# EAGLE design RH045.2 (EAGLE 7.1.0)
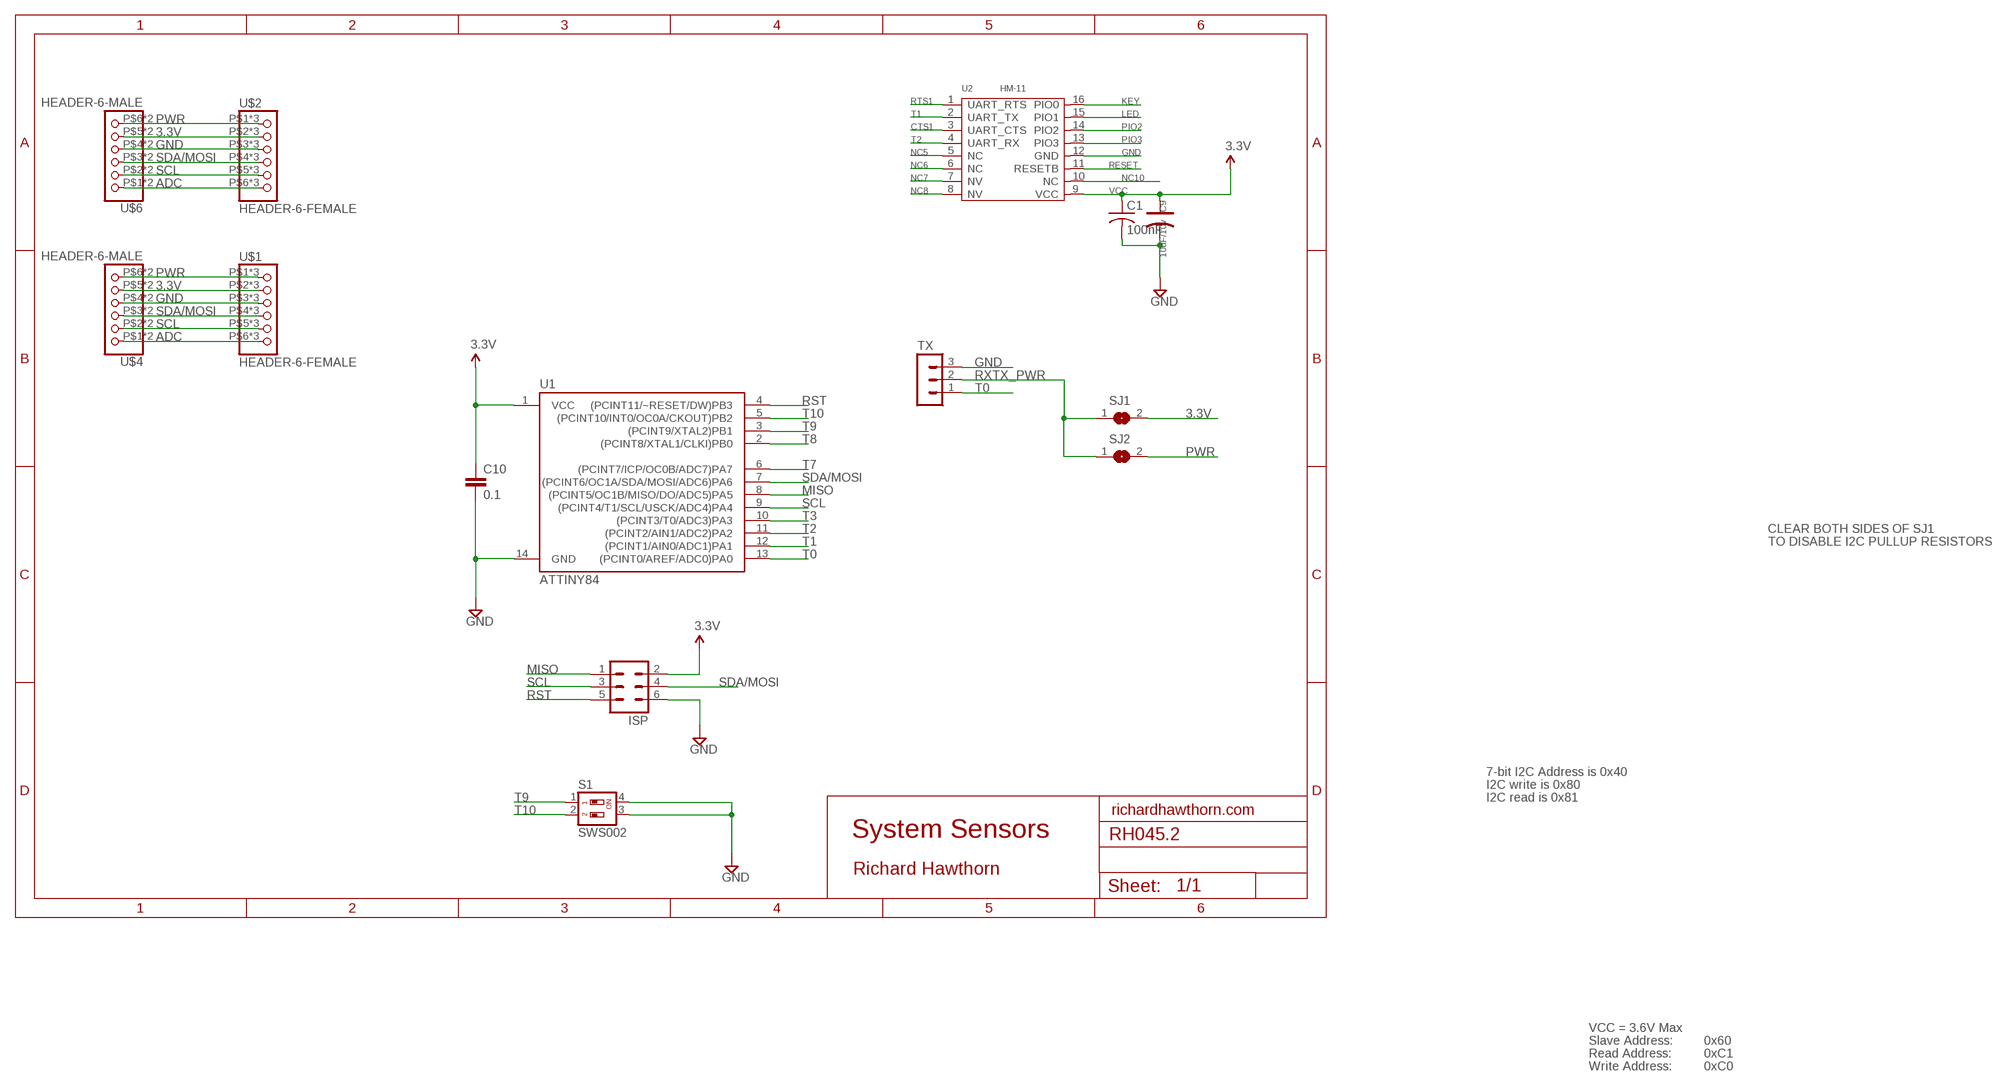
[diagram p0: schematic, sheet 1]

## Parts
C1  100nF  C-USC0805  [C0805]
C9  10uF/10v  CAP-AVX-A  [AVX-A]
C10  0.1  CAP0603-CAP  [0603-CAP]
ISP  MA03-2  [MA03-2]
S1  SWS002  [SMS-002]
SJ1  SJ  [SJ]
SJ2  SJ  [SJ]
TX  MA03-1  [MA03-1]
U1  ATTINY84  [SO14]
U2  HM-11  [16P-18.5X13.5X0.8]
U$1  HEADER-6-FEMALE  [2MMHEADER6]
U$2  HEADER-6-FEMALE  [2MMHEADER6]
U$4  HEADER-6-MALE  [2MMHEADERPIN6]
U$6  HEADER-6-MALE  [2MMHEADERPIN6]

## Nets
3.3V: C10.1 ISP.2 SJ1.2 U1.1(VCC) U$1.P$2 U$1.P$10 U$1.P$18 U$2.P$2 U$2.P$10 U$2.P$18 U$4.P$5 U$4.P$13 U$6.P$5 U$6.P$13
ADC: U$1.P$6 U$1.P$14 U$1.P$22 U$2.P$6 U$2.P$14 U$2.P$22 U$4.P$1 U$4.P$9 U$6.P$1 U$6.P$9
CTS1: U2.3(UART_CTS)
GND [power]: C1.2 C9.- C10.2 ISP.6 S1.3 S1.4 TX.3 U1.14(GND) U2.12(GND) U$1.P$3 U$1.P$11 U$1.P$19 U$2.P$3 U$2.P$11 U$2.P$19 U$4.P$4 U$4.P$12 U$6.P$4 U$6.P$12
KEY: U2.16(PIO0)
LED: U2.15(PIO1)
MISO: ISP.1 U1.8((PCINT5/OC1B/MISO/DO/ADC5)PA5)
NC5: U2.5(NC)
NC6: U2.6(NC)
NC7: U2.7(NV)
NC8: U2.8(NV)
NC10: U2.10(NC)
PIO2: U2.14(PIO2)
PIO3: U2.13(PIO3)
PWR [power]: SJ2.2 U$1.P$1 U$1.P$9 U$1.P$17 U$2.P$1 U$2.P$9 U$2.P$17 U$4.P$6 U$4.P$14 U$6.P$6 U$6.P$14
RESET: U2.11(RESETB)
RST: ISP.5 U1.4((PCINT11/~RESET/DW)PB3)
RTS1: U2.1(UART_RTS)
RXTX_PWR: SJ1.1 SJ2.1 TX.2
SCL: ISP.3 U1.9((PCINT4/T1/SCL/USCK/ADC4)PA4) U$1.P$5 U$1.P$13 U$1.P$21 U$2.P$5 U$2.P$13 U$2.P$21 U$4.P$2 U$4.P$10 U$6.P$2 U$6.P$10
SDA/MOSI: ISP.4 U1.7((PCINT6/OC1A/SDA/MOSI/ADC6)PA6) U$1.P$4 U$1.P$12 U$1.P$20 U$2.P$4 U$2.P$12 U$2.P$20 U$4.P$3 U$4.P$11 U$6.P$3 U$6.P$11
T0: TX.1 U1.13((PCINT0/AREF/ADC0)PA0)
T1: U1.12((PCINT1/AIN0/ADC1)PA1) U2.2(UART_TX)
T2: U1.11((PCINT2/AIN1/ADC2)PA2) U2.4(UART_RX)
T3: U1.10((PCINT3/T0/ADC3)PA3)
T7: U1.6((PCINT7/ICP/OC0B/ADC7)PA7)
T8: U1.2((PCINT8/XTAL1/CLKI)PB0)
T9: S1.1 U1.3((PCINT9/XTAL2)PB1)
T10: S1.2 U1.5((PCINT10/INT0/OC0A/CKOUT)PB2)
VCC: C1.1 C9.+ U2.9(VCC) ; supply symbol labelled 3.3V

## Notes on the sheet
- CLEAR BOTH SIDES OF SJ1
- TO DISABLE I2C PULLUP RESISTORS
- 7-bit I2C Address is 0x40
- I2C write is 0x80
- I2C read is 0x81
- richardhawthorn.com
- System Sensors
- Richard Hawthorn
- VCC = 3.6V Max
- Slave Address: | 0x60
- Read Address: | 0xC1
- Write Address: | 0xC0

## Library data of the parts
C1 = resistor:C-US: CAPACITOR, American symbol
C9 = Discrete:CAP*: Electrolytic Capacitors,Tantalum Capacitors and Super Capacitors
C10 = LowPowerLab:CAP: Capacitor Standard 0603 ceramic capacitor, and 0.1" leaded capacitor.
ISP = Richards:MA03-2: PIN HEADER; OC_FARNELL: unknown; OC_NEWARK: unknown
S1 = smd-special:SWS002: SMD Dip Switch 2 pol.
SJ1 SJ2 = jumper:SJ: SMD solder JUMPER
TX = con-lstb:MA03-1: PIN HEADER; OC_FARNELL: unknown; OC_NEWARK: unknown
U1 = SparkFun-DigitalIC:ATTINY84: Atmel 14-pin 2/4/8kB flash uC
U2 = template:HM-11: Bluetooth Specification V4.0 BLE
U$1 U$2 = Richards:HEADER-6-FEMALE
U$4 U$6 = Richards:HEADER-6-MALE

## Net classes
1 power: width 0.381 mm, clearance 0.254 mm

## Board
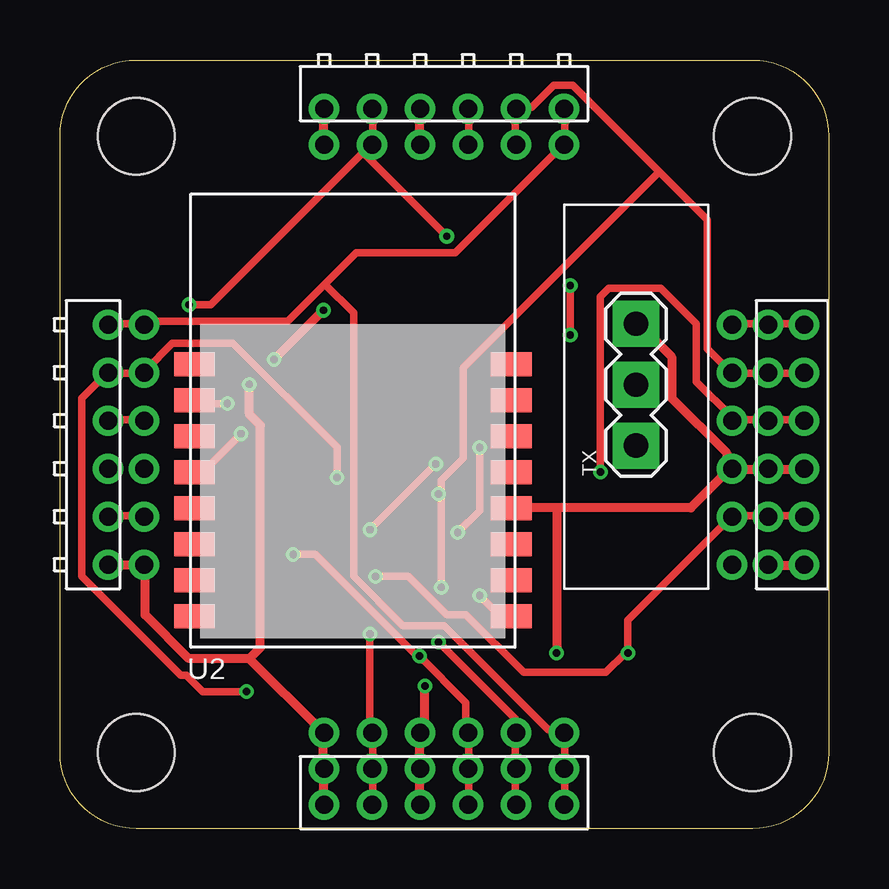
[diagram p1: board, top side]
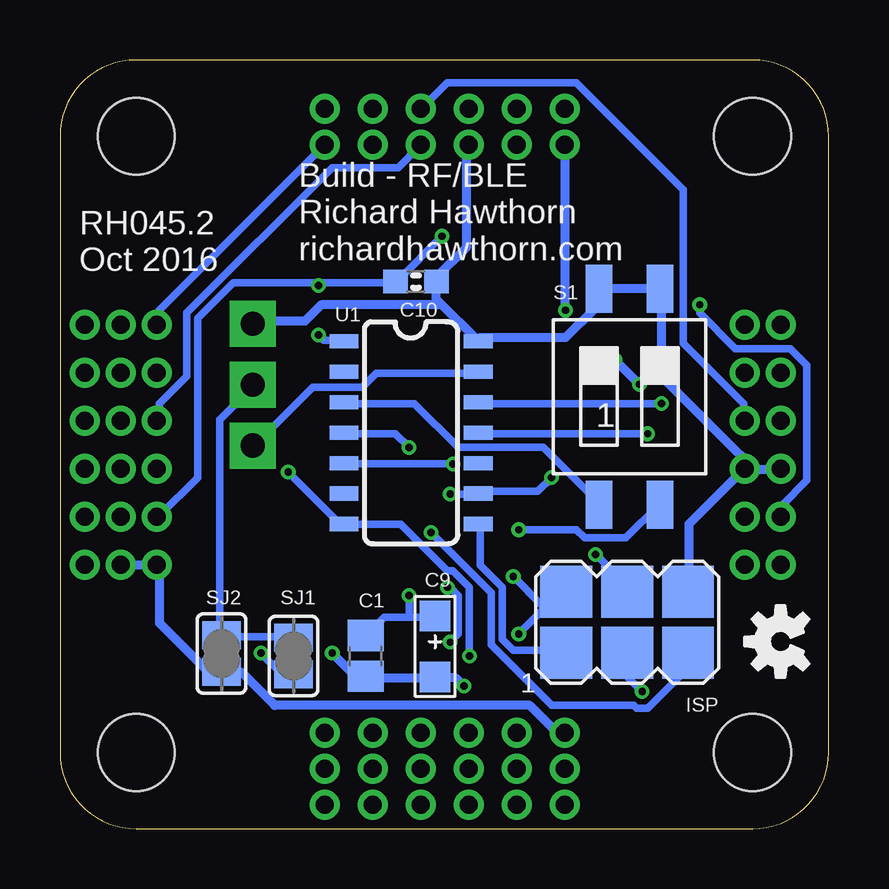
[diagram p2: board, bottom side, seen from below]

Size 32.03 x 32.03 mm. Coordinates in mm from the lower left corner, seen from the top.
Outline: 0,3.17 0,28.86 arc-90 3.17,32.03 28.86,32.03 arc-90 32.03,28.86 32.03,3.17 arc-90 28.86,0 3.17,0 arc-90 0,3.17
Copper layers (1*16): Top 0.035mm / dielectric 1.5mm / Bottom 0.035mm
Design rules "ITEADstudio_DRC *": minimum track width 12mil, minimum drill 12mil, track to track 6mil, track to pad 6mil, pad to pad 6mil, via to via 6mil, smd to smd 0mil, copper to edge 10mil, drill to drill 10mil, minimum pad ring 10mil, minimum via ring 6mil, stop-mask expansion 2mil, vias tented up to drill 100mil, thermal gap 15mil
Holes 3.2 mm at 3.17,3.17 28.86,3.17 3.17,28.86 28.86,28.86
tRestrict: area 0,0 to 5.7,5.7; area 26.3,0 to 32,5.7; area 26.3,26.3 to 32,32; area 0,26.3 to 5.7,32
bRestrict: area 0,26.3 to 5.7,32; area 26.3,26.3 to 32,32; area 26.3,0 to 32,5.7; area 0,0 to 5.7,5.7

### Footprints (pad centres in the part's own frame; a part is rotated, then mirrored left to right if it is on the bottom)
C0805 = smd 1.3 x 1.5: 1 -0.85,0; 2 0.85,0
AVX-A = smd 1.27 x 1.27: + -1.27,0; - 1.27,0
0603-CAP = smd 1.016 x 0.965: 1 -0.85,0; 2 0.85,0
MA03-2 = smd 2.159 x 2.159: 1 -2.54,-1.27; 2 -2.54,1.27; 3 0,-1.27; 4 0,1.27; 5 2.54,-1.27; 6 2.54,1.27
SMS-002 = smd 1.092 x 2.007: 1 -1.27,-4.496; 2 1.27,-4.496; 3 1.27,4.496; 4 -1.27,4.496
SJ = smd 1.168 x 1.6: 1 -0.762,0; 2 0.762,0
MA03-1 = drill 1.016 pad 1.93 square: 1 -2.54,0; 2 0,0; 3 2.54,0
SO14 = smd 0.6 x 1.2: 1 -3.81,-2.8; 2 -2.54,-2.8; 3 -1.27,-2.8; 4 0,-2.8; 5 1.27,-2.8; 6 2.54,-2.8; 7 3.81,-2.8; 8 3.81,2.8; 9 2.54,2.8; 10 1.27,2.8; 11 0,2.8; 12 -1.27,2.8; 13 -2.54,2.8; 14 -3.81,2.8
16P-18.5X13.5X0.8 = smd 1.7 x 1: 1 -6.6,2.15; 2 -6.6,0.65; 3 -6.6,-0.85; 4 -6.6,-2.35; 5 -6.6,-3.85; 6 -6.6,-5.35; 7 -6.6,-6.85; 8 -6.6,-8.35; 9 6.6,-8.35; 10 6.6,-6.85; 11 6.6,-5.35; 12 6.6,-3.85; 13 6.6,-2.35; 14 6.6,-0.85; 15 6.6,0.65; 16 6.6,2.15
2MMHEADER6 = drill 0.75: P$1 1,5; P$2 1,3; P$3 1,1; P$4 1,-1; P$5 1,-3; P$6 1,-5; P$9 -0.5,5; P$10 -0.5,3; P$11 -0.5,1; P$12 -0.5,-1; P$13 -0.5,-3; P$14 -0.5,-5; P$17 -2,5; P$18 -2,3; P$19 -2,1; P$20 -2,-1; P$21 -2,-3; P$22 -2,-5
2MMHEADERPIN6 = drill 0.75: P$1 1,5; P$2 1,3; P$3 1,1; P$4 1,-1; P$5 1,-3; P$6 1,-5; P$9 -0.5,5; P$10 -0.5,3; P$11 -0.5,1; P$12 -0.5,-1; P$13 -0.5,-3; P$14 -0.5,-5

### Placement (x,y rotation side)
C1  19.3,7.2 270 bottom
C9  16.4,7.6 270 bottom
C10  17.2,22.8 0 bottom
ISP  8.4,8.6 0 bottom
S1  8.3,18 0 bottom
SJ1  22.3,7.2 270 bottom
SJ2  25.3,7.3 270 bottom
TX  24,18.5 90 top
U1  17.4,16.5 270 bottom
U2  12.2,17.2 0 top
U$1  29,16 180 top
U$2  16,3 90 top
U$3  [OSHW-LOGO-S]  2,7.8 90 bottom
U$4  16,29.5 270 top
U$6  2.5,16 0 top

### Tracks (layer width: path | path; a pad name or v marks a point on that pad's centre or on a via)
3.3V  (via drill 0.3)
  Top 0.305: U$6.P$13 2.06,13.03 3.43,13.03 U$6.P$5 | U$4.P$5 13.03,28.57 13.03,29.95 U$4.P$13 | v5.37,21.83 6.29,21.83 12.92,28.46 U$4.P$5 | U$2.P$18 13.03,1.03 13.03,2.4 U$2.P$10 13.03,2.63 13.03,3.89 U$2.P$2 12.92,4 v12.92,8.12 | v21.26,22.63 v21.26,20.57 | U$1.P$18 30.98,13.03 29.6,13.03 U$1.P$10 29.49,13.03 28.12,13.03 U$1.P$2 27.89,12.92 23.66,8.69 v23.66,7.32 23.55,7.32 22.75,6.51 19.32,6.51 16.92,8.91 16.12,8.91 14.52,10.52 v13.14,10.52 | v16.12,24.69 12.69,28.12 U$4.P$5
  Bottom 0.305: v5.37,21.83 5.37,21.49 3.89,20 1.6,20 0.91,19.32 0.91,14.52 1.94,13.49 1.94,13.03 U$6.P$13 | v12.92,8.12 11.2,9.83 10.97,9.83 ISP.2 11.89,9.26 v13.14,10.52 | 21.26,22.75 24.8,22.75 26.29,21.26 26.29,14.63 27.89,13.03 U$1.P$2 | 21.26,22.75 18.06,22.75 C10.1 17.95,22.86 v16.12,24.69 | v21.26,20.57 21.03,20.34 20.23,20.34 U1.1 | v21.26,22.63 21.26,22.75 | v23.66,7.32 22.86,6.51 22.4,6.51 SJ1.2
ADC
  Top 0.305: U$1.P$6 28,21.03 29.49,21.03 U$1.P$14 29.6,21.03 30.98,21.03 U$1.P$22 | U$2.P$22 21.03,1.03 21.03,2.4 U$2.P$14 21.03,2.63 21.03,3.89 U$2.P$6 20.92,4.12 20.34,4.12 16,8.46 14.29,8.46 12.23,10.52 12.23,21.49 11.03,22.69 | U$6.P$9 2.06,21.03 3.43,21.03 U$6.P$1 3.54,21.14 9.49,21.14 11.03,22.69 | U$4.P$9 21.03,29.95 21.03,28.57 U$4.P$1 20.92,28.46 16.46,24 12.34,24 11.03,22.69
  Bottom 0.305: U$1.P$6 27.89,21.03 27.89,21.6 21.03,28.46 U$4.P$1
GND  (via drill 0.3)
  Top 0.381: U$2.P$19 14.97,1.03 14.97,2.4 U$2.P$11 14.97,2.63 14.97,3.89 U$2.P$3 15.09,4 15.2,4.12 v15.2,5.94 | 20.69,13.37 26.29,13.37 27.89,14.97 U$1.P$3 | 20.69,13.37 18.86,13.37 U2.12 | U$1.P$3 28.12,14.97 29.49,14.97 U$1.P$11 29.6,14.97 30.98,14.97 U$1.P$19 | 20.69,13.37 v20.69,7.32 | U$4.P$4 14.97,28.57 14.97,29.95 U$4.P$12 | U$1.P$3 27.77,15.09 27.77,15.66 25.49,17.95 25.49,19.66 24,21.14 TX.3
  Bottom 0.381: v15.2,5.94 15.54,6.29 16.23,6.29 C9.- 16.46,6.29 19.2,6.29 C1.2 19.43,6.4 19.77,6.4 v20.69,7.32 | ISP.6 5.83,9.94 5.83,12.69 3.54,14.97 U$6.P$4 | U$6.P$12 2.06,14.97 3.31,14.97 U$6.P$4 | 16.23,21.95 14.63,20.34 U1.14 14.52,20.46 10.97,20.46 9.72,21.72 9.72,22.4 S1.4 9.49,22.52 7.09,22.52 S1.3 6.97,22.4 6.97,18.86 3.66,15.54 3.66,15.09 U$6.P$4 | 16.23,21.95 16.34,22.06 16.34,22.75 C10.2 16.34,22.97 15.09,24.23 15.09,28.46 U$4.P$4 | TX.3 23.89,21.14 21.83,21.14 21.14,21.83 16.34,21.83 16.23,21.95
MISO
  Bottom 0.305: U1.8 14.52,12.69 14.52,10.97 13.6,10.06 13.6,7.89 13.14,7.43 10.97,7.43 ISP.1
PWR  (via drill 0.3)
  Top 0.381: U$1.P$17 30.98,10.97 29.6,10.97 U$1.P$9 | U$4.P$6 10.97,28.57 10.97,29.95 U$4.P$14 | U$6.P$14 2.06,10.97 3.43,10.97 U$6.P$6 3.54,10.86 3.54,8.91 5.37,7.09 7.89,7.09 | U$2.P$17 10.97,1.03 10.97,2.4 U$2.P$9 10.97,2.63 10.97,3.89 U$2.P$1 10.86,4.12 7.89,7.09 | v8.91,19.55 v10.97,21.6 | v7.89,18.52 7.89,17.26 8.34,16.8 8.34,7.54 7.89,7.09
  Bottom 0.381: U$1.P$9 29.49,10.97 28.12,10.97 U$1.P$1 27.89,10.97 27.89,8.57 25.95,6.63 25.38,6.63 SJ2.2 25.15,6.51 24.46,6.51 23.09,5.14 12.46,5.14 11.32,4 11.09,4 U$2.P$1 | v10.97,21.6 10.97,28.46 U$4.P$6 | v7.89,18.52 v8.91,19.55
RST  (via drill 0.3)
  Top 0.305: v17.49,15.89 17.49,13.26 v16.57,12.34
  Bottom 0.305: v17.49,15.89 18.06,16.46 20.12,16.46 U1.4 | v16.57,12.34 14.06,9.83 14.06,7.66 11.54,5.14 8.12,5.14 8,5.03 7.54,5.03 5.94,6.63 5.94,7.32 ISP.5
RXTX_PWR
  Bottom 0.305: SJ1.1 22.4,8 25.26,8 SJ2.1 25.38,8.12 25.38,17.03 24,18.4 TX.2
SCL  (via drill 0.3)
  Top 0.305: v11.54,14.63 11.54,15.89 7.2,20.23 4.69,20.23 3.54,19.09 U$6.P$2 3.43,18.97 2.06,18.97 U$6.P$10 1.94,18.97 0.91,17.95 0.91,10.52 5.03,6.4 5.26,6.4 5.94,5.71 v7.77,5.71 | U$2.P$21 18.97,1.03 18.97,2.4 U$2.P$13 18.97,2.63 18.97,3.89 U$2.P$5 18.97,4.12 18.97,4.57 v15.77,7.77 | U$4.P$2 18.97,28.57 18.97,29.95 U$4.P$10 19.09,30.06 19.66,30.06 20.57,30.98 21.37,30.98 24.98,27.38 | U$1.P$21 30.98,18.97 29.6,18.97 U$1.P$13 29.49,18.97 28,18.97 U$1.P$5 27.89,19.09 26.98,20 26.98,25.38 24.98,27.38 | 15.89,13.95 15.89,14.52 16.8,15.43 16.8,19.2 24.98,27.38 | 15.89,13.95 v15.89,10.06 | v15.77,13.95 15.89,13.95
  Bottom 0.305: v11.54,14.63 12.12,14.06 14.52,14.06 U1.9 14.74,13.95 v15.77,13.95 | v7.77,5.71 8.34,6.29 8.34,7.32 ISP.3 | v15.77,7.77 15.43,8.12 15.43,9.72 15.77,10.06 v15.89,10.06
SDA/MOSI  (via drill 0.3)
  Top 0.305: U$2.P$20 17.03,1.03 17.03,2.4 U$2.P$12 17.03,2.63 17.03,3.89 U$2.P$4 16.92,4 16.92,5.26 v14.97,7.2 14.86,7.2 10.63,11.43 v9.72,11.43 | U$1.P$20 30.98,17.03 29.6,17.03 U$1.P$12 29.49,17.03 28,17.03 U$1.P$4 28,17.14 26.52,18.63 26.52,21.03 25.03,22.52 22.86,22.52 22.52,22.17 v22.52,14.86 | U$6.P$11 2.06,17.03 3.43,17.03 U$6.P$3 | U$4.P$3 17.03,28.57 17.03,29.95 U$4.P$11
  Bottom 0.305: v14.97,7.2 14.97,10.06 15.66,10.74 15.89,10.74 17.83,12.69 20.12,12.69 U1.7 20.34,12.69 v22.52,14.86 | v9.72,11.43 8.46,10.17 8.46,9.94 ISP.4 | U$6.P$3 3.54,17.03 3.54,17.72 6.06,20.23 6.06,26.63 10.52,31.09 15.89,31.09 16.92,30.06 U$4.P$11 | U$1.P$4 27.89,17.03 27.89,17.72 26.75,18.86 26.75,21.49 20.69,27.55 17.95,27.55 17.03,28.46 U$4.P$3
T0
  Bottom 0.305: U1.13 14.63,18.97 18.86,18.97 19.43,18.4 21.49,18.4 23.89,16 TX.1
T1  (via drill 0.3)
  Top 0.305: v6.97,17.72 5.71,17.72 5.6,17.83 U2.2
  Bottom 0.305: v6.97,17.72 14.52,17.72 U1.12
T2  (via drill 0.3)
  Top 0.305: v7.54,16.46 5.94,14.86 U2.4
  Bottom 0.305: v7.54,16.46 14.52,16.46 U1.11
T9
  Bottom 0.305: U1.3 20.12,17.72 17.26,17.72 15.43,15.89 11.89,15.89 9.6,13.6 S1.1
T10  (via drill 0.3)
  Top 0.305: v12.92,12.46 v15.66,15.2
  Bottom 0.305: v15.66,15.2 20.12,15.2 U1.5 | v12.92,12.46 10.52,12.46 10.17,12.12 8.46,12.12 7.09,13.49 S1.2
VCC  (via drill 0.3)
  Top 0.305: v17.49,9.72 18.29,8.91 18.75,8.91 U2.9
  Bottom 0.305: 17.49,8.8 18.52,8.8 19.2,8.12 C1.1 | 17.49,8.8 16.46,8.8 C9.+ | 17.49,8.8 v17.49,9.72

### Text on the board
bPlace: Build - RF/BLE / Richard Hawthorn / richardhawthorn.com | RH045.2 / Oct 2016
tDocu: REG